# EAGLE design Transceiver_KW1_Sachs (EAGLE 9.6.2)
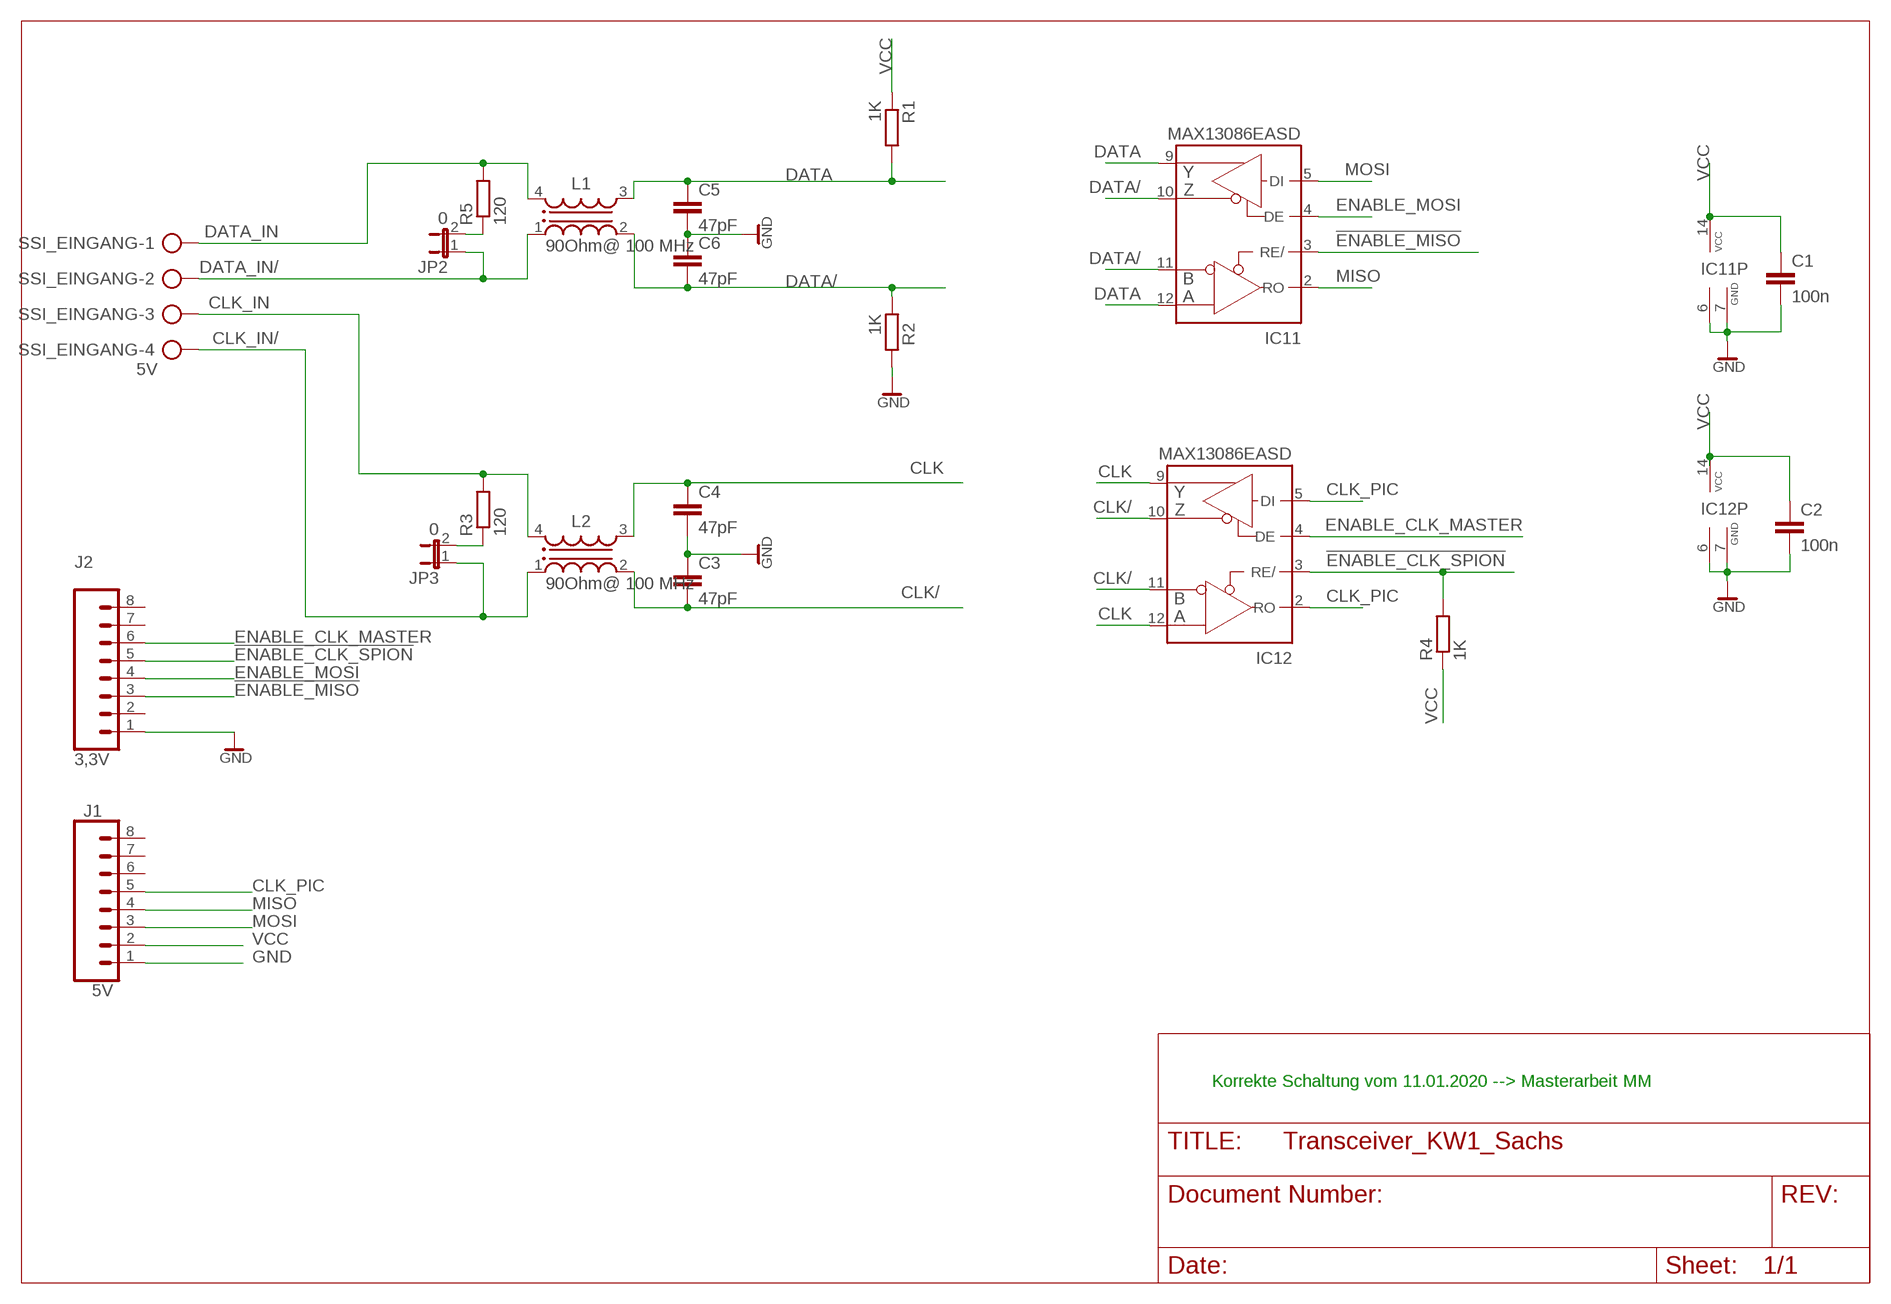
[diagram p0: schematic, sheet 1]

## Parts
C1  100n  C-EUC0603  [C0603]
C2  100n  C-EUC0603  [C0603]
C3  47pF  C-EUC0603  [C0603]
C4  47pF  C-EUC0603  [C0603]
C5  47pF  C-EUC0603  [C0603]
C6  47pF  C-EUC0603  [C0603]
IC11  MAX13086EASD  MAX489CPDSO14  [SO14]
IC12  MAX13086EASD  MAX489CPDSO14  [SO14]
J1  5V  CONN_08"  [1X08]
J2  3,3V  CONN_08"  [1X08]
JP2  0  JP1E  [JP1]
JP3  0  JP1E  [JP1]
L1  90Ohm@ 100 MHz  WE-CNSW_0805_744231091  [WE-CNSW_0805]
L2  90Ohm@ 100 MHz  WE-CNSW_0805_744231091  [WE-CNSW_0805]
R1  1K  R-EU_R0603  [R0603]
R2  1K  R-EU_R0603  [R0603]
R3  120  R-EU_R0603  [R0603]
R4  1K  R-EU_R0603  [R0603]
R5  120  R-EU_R0603  [R0603]
SSI_EINGANG  5V  AK500/4-H  [AK500/4-H]

## Nets
!ENABLE_CLK_SPION!: IC12.3(RE/) J2.5 R4.2
!ENABLE_MISO!: IC11.3(RE/) J2.3
CLK: C4.1 IC12.9(Y) IC12.12(A) L2.3
CLK/: C3.2 IC12.10(Z) IC12.11(B) L2.2
CLK_IN: L2.4 R3.2 SSI_EINGANG.3
CLK_IN/: JP3.1 L2.1 SSI_EINGANG.4
CLK_PIC: IC12.2(RO) IC12.5(DI) J1.5
DATA: C5.1 IC11.9(Y) IC11.12(A) L1.3 R1.2
DATA/: C6.2 IC11.10(Z) IC11.11(B) L1.2 R2.1
DATA_IN: L1.4 R5.2 SSI_EINGANG.1
DATA_IN/: JP2.1 L1.1 SSI_EINGANG.2
ENABLE_CLK_MASTER: IC12.4(DE) J2.6
ENABLE_MOSI: IC11.4(DE) J2.4
GND: C1.2 C2.2 C3.1 C4.2 C5.2 C6.1 IC11.6(GND) IC11.7(GND) IC12.6(GND) IC12.7(GND) J1.1 J2.1 R2.2
MISO: IC11.2(RO) J1.4
MOSI: IC11.5(DI) J1.3
N$1: JP2.2 R5.1
N$3: JP3.2 R3.1
VCC: C1.1 C2.1 IC11.14(VCC) IC12.14(VCC) J1.2 R1.1 R4.1
Unconnected: IC11.1(NC) IC11.8(NC) IC11.13(NC) IC12.1(NC) IC12.8(NC) IC12.13(NC) J1.6 J1.7 J1.8 J2.2 J2.7 J2.8

## Notes on the sheet
- Korrekte Schaltung vom 11.01.2020 --> Masterarbeit MM

## Library data of the parts
C1-C6 = rcl:C-EU: CAPACITOR, European symbol; SPICEPREFIX: C
IC11 IC12 = maxim:MAX489CPD: RS485 TRANSEIVER
J1 J2 = SparkFun-Connectors:CONN_08: Multi connection point. Often used as Generic Header-pin footprint for 0.1 inch spaced/style header connections On any of the 0.1 inch spaced packages, you can populate with these: Break Away Headers - Straight <https://www.sparkfun.com/products/116> (PRT-00116) Break Away Male Headers - Right Angle <https://www.sparkfun.com/products/553> (PRT-00553) Female Headers <https://www.sparkfun.com/products/115> (PRT-00115) Break Away Headers - Machine Pin <https://www.sparkfun.com/products/117> (PRT-00117) Break Away Female Headers - Swiss Machine Pin <https://www.sparkfun.com/products/743> (PRT-00743) Arduino Stackable Header - 8 Pin <https://www.sparkfun.com/products/9279> (PRT-09279) For SCREWTERMINALS and SPRING TERMINALS visit here: Screw Terimnals on SparkFun.com <https://www.sparkfun.com/search/results?term=Screw+Terminals> (5mm/3.5mm/2.54mm spacing) This device is also useful as a general connection point to wire up your design to another part of your project. Our various solder wires solder well into these plated through hole pads. Hook-Up Wire - Assortment (Stranded, 22 AWG) <https://www.sparkfun.com/products/11375> (PRT-11375) Hook-Up Wire - Assortment (Solid Core, 22 AWG) <https://www.sparkfun.com/products/11367> (PRT-11367) View the entire wire category on our website here <https://www.sparkfun.com/categories/141> Special notes: Molex polarized connector foot print use with SKU : PRT-08231 with associated crimp pins and housings. 1MM SMD Version SKU: PRT-10208 NOTES ON THE VARIANTS LOCK and LOCK_LONGPADS... This footprint was designed to help hold the alignment of a through-hole component (i.e. 6-pin header) while soldering it into place. You may notice that each hole has been shifted either up or down by 0.005 of an inch from it's more standard position (which is a perfectly straight line). This slight alteration caused the pins (the squares in the middle) to touch the edges of the holes. Because they are alternating, it causes a "brace" to hold the component in place. 0.005 has proven to be the perfect amount of "off-center" position when using our standard breakaway headers. Although looks a little odd when you look at the bare footprint, once you have a header in there, the alteration is very hard to notice. Also,if you push a header all the way into place, it is covered up entirely on the bottom side.; PROD_ID: CONN-08438
JP2 JP3 = jumper:JP1E: JUMPER
L1 L2 = Eagle_WE-CNSW (rev19a):WE-CNSW_0805: WE-CNSW SMD Common Mode Line Filter Characteristics Current compensated data line filter High common mode noise suppression at high frequencies Small influence on high speed signals through winding symmetry Climatic category 40/105/21 (Size 0603) Climatic category 40/125/21 (Size 0805/1206/1812) Flammability corresponding to UL 94 V-0 Applications USB 2.0 IEEE 1394 (Firewire) LVDS High Speed Data Lines LAN <https://katalog.we-online.com/media/images/v2/o14771v209%20we-cnsw_stroko_smd_gruppe.jpg> Details see: http://katalog.we-online.de/en/pbs/WE-CNSW Updated by Ella Wu 2019-01-09 2019 (C) Wurth Elektronik; DATASHEET-URL: https://katalog.we-online.com/pbs/datasheet/744231091.pdf; IR: 370mA; MOUNT: SMT; PART-NUMBER: 744231091; RDC: 0.3Ohm; VR: 50V; VT: 125 V (AC)
R1-R5 = rcl:R-EU_: RESISTOR, European symbol; SPICEPREFIX: R
SSI_EINGANG = con-ptr500:AK500/4-H: CONNECTOR Aug. 2004 / PTR Meßtechnik: Die Bezeichnung der Serie AK505 wurde geändert. Es handelt sich hierbei um AK500 in horizontaler Ausführung.; OC_FARNELL: unknown; OC_NEWARK: unknown

## Net classes
4 50mil: width 1.27 mm, drill 0.305 mm, clearance 0.205 mm to class 0, clearance 0.205 mm to class 1, clearance 0.205 mm to class 2, clearance 0.205 mm to class 3, clearance 0.205 mm

## Board
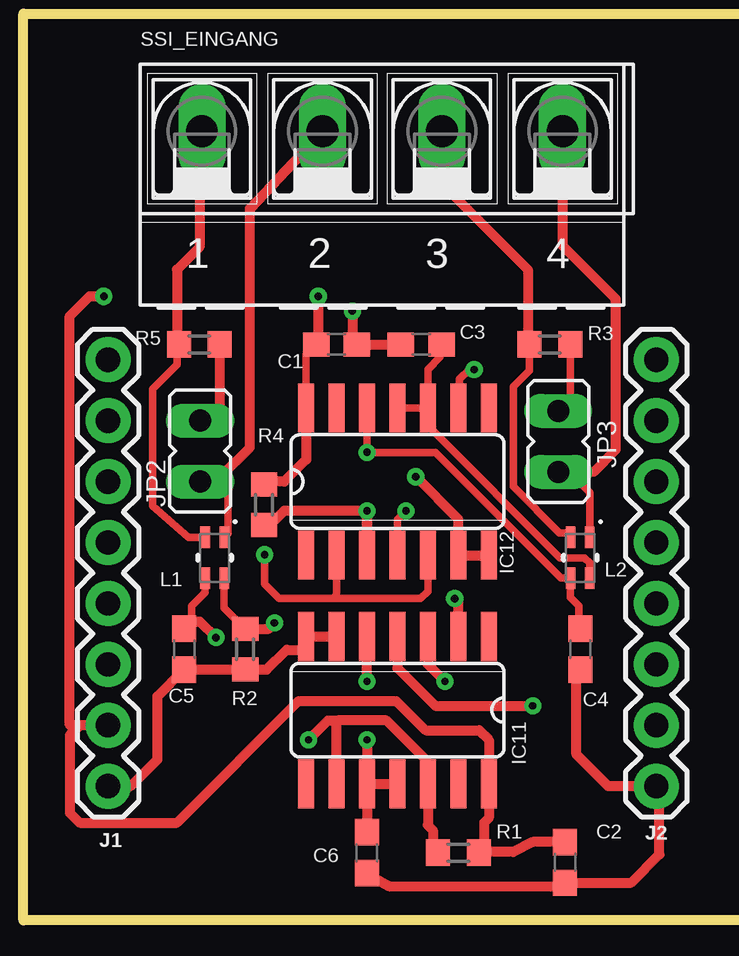
[diagram p1: board, top side]
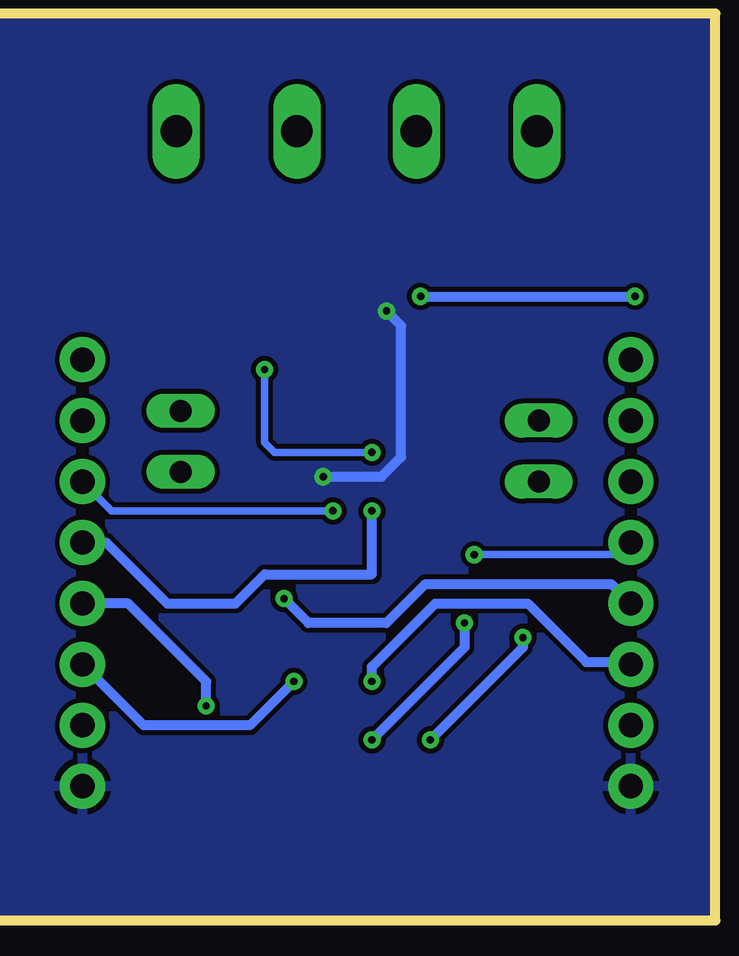
[diagram p2: board, bottom side, seen from below]

No outline drawn. Coordinates in mm, seen from the top.
Copper layers (1*16): Top 0.035mm / dielectric 1.5mm / Bottom 0.035mm
Design rules "default *": minimum track width 8mil, minimum drill 12mil, track to track 8mil, track to pad 8mil, pad to pad 8mil, via to via 8mil, smd to smd 8mil, copper to edge 12mil, drill to drill 8mil, minimum pad ring 10mil, minimum via ring 8mil, stop-mask expansion 4mil, vias tented up to drill 0mil, thermal gap 10mil
Milling: 4 lines

### Footprints (pad centres in the part's own frame; a part is rotated, then mirrored left to right if it is on the bottom)
C0603 = smd 1.1 x 1: 1 -0.85,0; 2 0.85,0
SO14 = smd 0.66 x 2.032: 1 -3.81,-3.073; 2 -2.54,-3.073; 3 -1.27,-3.073; 4 0,-3.073; 5 1.27,-3.073; 6 2.54,-3.073; 7 3.81,-3.073; 8 3.81,3.073; 9 2.54,3.073; 10 1.27,3.073; 11 0,3.073; 12 -1.27,3.073; 13 -2.54,3.073; 14 -3.81,3.073
1X08 = drill 1.016 pad 1.88: 1 0,0; 2 2.54,0; 3 5.08,0; 4 7.62,0; 5 10.16,0; 6 12.7,0; 7 15.24,0; 8 17.78,0
JP1 = drill 0.914 long: 1 0,-1.27; 2 0,1.27
WE-CNSW_0805 = smd 0.9 x 0.4: 1 -0.85,0.4; 2 0.85,0.4; 3 0.85,-0.4; 4 -0.85,-0.4
R0603 = smd 1 x 1.1: 1 -0.85,0; 2 0.85,0
AK500/4-H = drill 1.321 long: 1 -7.518,0; 2 -2.489,0; 3 2.489,0; 4 7.518,0

### Placement (x,y rotation side)
C1  29.21,20.95 0 top
C2  38.73,-0.64 270 top
C3  32.74,20.95 0 top
C4  39.37,8.26 270 top
C5  22.86,8.26 270 top
C6  30.48,-0.23 90 top
IC11  31.75,5.71 180 top
IC12  31.75,15.24 0 top
J1  19.68,2.54 90 top
J2  42.55,2.54 90 top
JP2  23.52,16.51 0 top
JP3  38.46,16.92 0 top
L1  24.13,12.06 270 top
L2  39.37,12.06 270 top
R1  34.29,-0.23 180 top
R2  25.4,8.26 270 top
R3  38.1,20.95 180 top
R4  26.19,14.27 270 top
R5  23.5,20.95 180 top
SSI_EINGANG  31.11,29.84 0 top

### Tracks (layer width: path | path; a pad name or v marks a point on that pad's centre or on a via)
!ENABLE_CLK_SPION!  (via drill 0.3)
  Top 0.406: R4.2 26.38,13.61 26.62,13.61 27.03,14.02 30.28,14.02 30.48,13.82 IC12.3 v30.48,14.02
  Bottom 0.406: J2.5 41.55,12.7 39.01,10.16 36.17,10.16 34.95,11.38 30.48,11.38 v30.48,14.02
!ENABLE_MISO!  (via drill 0.3)
  Top 0.406: IC11.3 33.02,7.62 v33.73,6.91
  Bottom 0.406: v33.73,6.91 35.56,5.08 40.01,5.08 J2.3
CLK  (via drill 0.3)
  Top 0.305: C4.1 39.32,9.16 39.32,10.06 38.97,10.41 L2.3 38.57,11.21 33.33,16.46 v30.48,16.46 IC12.12 | v34.95,19.91 34.75,19.91 34.34,19.51 34.34,18.36 IC12.9
  Bottom 0.305: v30.48,16.46 34.54,16.46 34.95,16.87 v34.95,19.91
CLK/
  Top 0.305: IC12.10 IC12.11 | IC12.10 33.02,19.91 33.53,20.42 33.53,20.89 C3.2 | L2.2 39.77,11.84 39.55,12.06 38.53,12.06 33.12,17.48 33.12,18.21 IC12.10
CLK_IN
  Top 0.305: R3.2 37.25,19.88 36.58,19.2 36.58,15.04 38.51,13.11 38.78,13.11 L2.4
  Top 0.406: SSI_EINGANG.3 33.6,27.66 37.19,24.08 37.19,21.02 R3.2
CLK_IN/
  Top 0.305: JP3.1 38.71,15.85 39.77,14.79 L2.1
  Top 0.406: SSI_EINGANG.4 38.63,25.07 40.84,22.86 40.84,16.56 39.93,15.65 JP3.1
CLK_PIC  (via drill 0.3)
  Top 0.305: IC12.5 33.02,10.67 32.72,10.36 29.06,10.36 | 29.06,10.36 26.82,10.36 26.21,10.97 v26.21,12.19 | IC12.2 29.21,10.52 29.06,10.36
  Bottom 0.305: v26.21,12.19 20.19,12.19 J1.5
DATA  (via drill 0.3)
  Top 0.305: L1.3 23.73,10.62 23.16,10.06 23.16,9.41 C5.1
  Top 0.406: R1.2 33.22,-0.01 33.22,0.71 33.02,0.91 IC11.12 32.92,2.74 32.92,3.66 31.29,5.28 29.26,5.28 | 29.26,5.28 28.85,5.28 v28.04,4.47 | 23.16,9.41 23.51,9.41 v24.18,8.74 | IC11.9 29.21,5.23 29.26,5.28
  Bottom 0.406: v24.18,8.74 24.18,8.33 v28.04,4.47
DATA/  (via drill 0.3)
  Top 0.305: L1.2 24.53,9.97 R2.1
  Top 0.406: IC11.10 C6.2 | IC11.10 IC11.11 | R2.1 26.38,9.11 v26.62,9.35 | v30.48,4.47 IC11.10
  Bottom 0.406: v26.62,9.35 26.62,8.33 v30.48,4.47
DATA_IN
  Top 0.305: L1.4 23.05,12.91 21.54,14.22 21.54,19.1 22.55,20.12 22.55,20.86 R5.2
  Top 0.406: SSI_EINGANG.1 23.5,29.84 23.5,25.02 22.55,24.08 22.55,21.05 R5.2
DATA_IN/
  Top 0.305: 24.69,14.94 24.69,13.07 L1.1
  Top 0.406: JP2.1 24.13,15.49 | 24.13,15.49 24.69,14.94 | 24.13,15.49 24.03,15.49 24.38,15.44 25.6,16.66 25.6,26.62 SSI_EINGANG.2
ENABLE_CLK_MASTER  (via drill 0.3)
  Top 0.305: IC12.4 31.75,13.66 v32.11,14.02
  Bottom 0.305: v32.11,14.02 41.33,14.02 J2.6
ENABLE_MOSI  (via drill 0.3)
  Top 0.406: IC11.4 31.75,7.47 33.33,5.89 v37.39,5.89
  Bottom 0.406: v37.39,5.89 37.39,6.91 40.64,10.16 J2.4
GND  (via drill 0.3)
  Top 0.406: C3.1 C1.2 29.87,21.14 v29.87,22.35 | IC12.6 IC12.7 | C5.2 R2.2 26.3,7.41 27.13,8.23 28.04,8.23 28.04,8.69 IC11.7 IC11.6 | C6.1 30.48,-1.12 31.39,-1.63 38.59,-1.63 C2.2 41.49,-1.49 42.67,-0.3 42.67,2.41 J2.1 40.54,2.54 39.22,3.86 39.22,7.25 C4.2 39.28,7.32 | C5.2 22.86,7.21 | J1.1 20.62,2.54 21.74,3.66 21.74,6.29 C5.2 | 34.34,12.12 IC12.6 | IC12.6 34.29,13.66 v32.51,15.44
  Bottom 0.406: v32.51,15.44 30.07,15.44 29.26,16.26 29.26,21.74 v29.87,22.35
  pour Bottom: 16.15,34.75 46.63,34.75 46.63,-3.05 16.15,-3.05
MISO  (via drill 0.3)
  Top 0.406: IC11.2 34.29,10.21 v34.14,10.36
  Bottom 0.406: J1.4 20.5,10.97 28.25,10.97 29.87,9.35 33.12,9.35 v34.14,10.36
MOSI  (via drill 0.3)
  Top 0.406: v30.48,6.91 IC11.5
  Bottom 0.406: 19.61,7.62 J1.3 19.79,7.72 21.54,7.72 23.98,10.16 27.84,10.16 30.48,7.52 v30.48,6.91
N$1
  Top 0.406: R5.1 24.34,18 JP2.2
N$3
  Top 0.305: R3.1 38.95,18.2 JP3.2
VCC  (via drill 0.3)
  Top 0.305: IC12.14 27.94,20.54 C1.1
  Top 0.406: C2.1 37.4,0.21 36.58,-0.2 35.16,-0.2 R1.1 35.36,-0.01 35.36,1.02 35.56,1.22 IC11.14 35.56,4.47 35.15,4.88 32.92,4.88 31.7,6.1 27.64,6.1 22.55,1.02 18.49,1.02 18.09,1.42 18.09,4.67 18.49,5.08 | J1.2 18.49,5.08 | IC12.14 27.94,16.15 27.03,15.24 26.3,15.24 R4.1 | 18.49,5.08 18.09,5.08 18.09,22.15 18.9,22.96 v19.51,22.96 | v28.45,22.96 28.45,21.04 C1.1
  Bottom 0.406: v28.45,22.96 v19.51,22.96